# Altium schematic sheet MCU.SchDoc
size A4
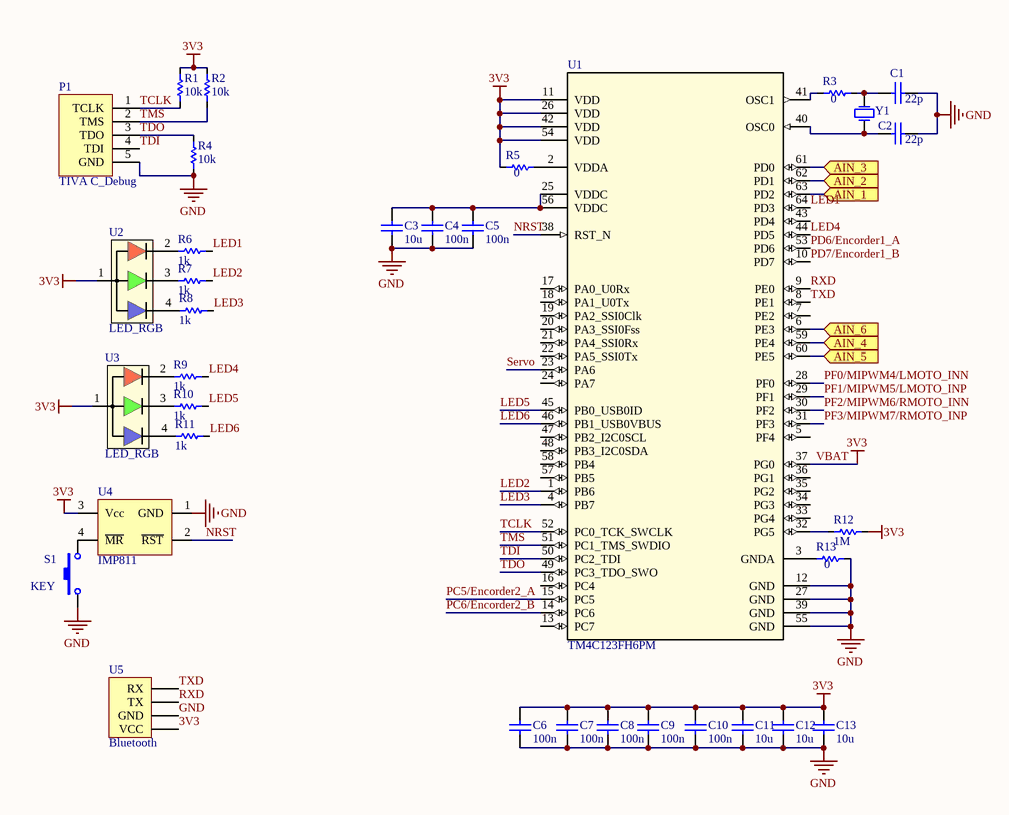
[diagram p0: MCU.SchDoc]

## Parts
C1  value 22p  [0603C]  (hidden comment: 1uF/0603/50V)
C2  value 22p  [0603C]  (hidden comment: 1uF/0603/50V)
C3  value 10u  [0603C]  (hidden comment: 1uF/0603/50V)
C4  value 100n  [0603C]  (hidden comment: 1uF/0603/50V)
C5  value 100n  [0603C]  (hidden comment: 1uF/0603/50V)
C6  value 100n  [0603C]  (hidden comment: 1uF/0603/50V)
C7  value 100n  [0603C]  (hidden comment: 1uF/0603/50V)
C8  value 100n  [0603C]  (hidden comment: 1uF/0603/50V)
C9  value 100n  [0603C]  (hidden comment: 1uF/0603/50V)
C10  value 100n  [0603C]  (hidden comment: 1uF/0603/50V)
C11  value 10u  [0603C]  (hidden comment: 1uF/0603/50V)
C12  value 10u  [0603C]  (hidden comment: 1uF/0603/50V)
C13  value 10u  [0603C]  (hidden comment: 1uF/0603/50V)
P1  TIVA C_Debug  [SMT_HEADER5]
R1  value 10k  [0603R]  (hidden comment: 1K/5%)
R2  value 10k  [0603R]  (hidden comment: 1K/5%)
R3  value 0  [0603R]  (hidden comment: 1K/5%)
R4  value 10k  [0603R]  (hidden comment: 1K/5%)
R5  value 0  [0603R]  (hidden comment: 1K/5%)
R6  value 1k  [0402]  (hidden comment: 1K/5%)
R7  value 1k  [0402]  (hidden comment: 1K/5%)
R8  value 1k  [0402]  (hidden comment: 1K/5%)
R9  value 1k  [0402]  (hidden comment: 1K/5%)
R10  value 1k  [0402]  (hidden comment: 1K/5%)
R11  value 1k  [0402]  (hidden comment: 1K/5%)
R12  value 1M  [0603R]  (hidden comment: 1K/5%)
R13  value 0  [0603R]  (hidden comment: 1K/5%)
S1  KEY  [SW-3x6mm-SMT]
U1  TM4C123FH6PM  [LQFP_64]
U2  LED_RGB  [0603 RGB]
U3  LED_RGB  [0603 RGB]
U4  IMP811  [SOT143]
U5  Bluetooth  [SMT_Female HEADER4]
Y1  XTAL  [NX5032GA]  (value not drawn)

## Ports
AIN_1 (in), AIN_2 (in), AIN_3 (in), AIN_4 (in), AIN_5 (in), AIN_6 (in)

## Nets
3V3: C6.2 C7.2 C8.2 C9.2 C10.2 C11.2 C12.2 C13.2 R1.1 R2.1 R5.2 R12.1 U1.11(VDD) U1.26(VDD) U1.37(PG0) U1.42(VDD) U1.54(VDD) U2.1(COM) U3.1(COM) U4.3(Vcc) U5.4(VCC)  [also labelled VBAT]
GND: C1.1 C2.1 C3.1 C4.1 C5.1 C6.1 C7.1 C8.1 C9.1 C10.1 C11.1 C12.1 C13.1 P1.5(GND) R4.2 R13.1 S1.2 U1.12(GND) U1.27(GND) U1.39(GND) U1.55(GND) U4.1(GND) U5.3(GND)
AIN_1: U1.63(PD2) ; port AIN_1
AIN_2: U1.62(PD1) ; port AIN_2
AIN_3: U1.61(PD0) ; port AIN_3
AIN_4: U1.59(PE4) ; port AIN_4
AIN_5: U1.60(PE5) ; port AIN_5
AIN_6: U1.6(PE3) ; port AIN_6
LED1: R6.2 U1.64(PD3)
LED2: R7.2 U1.1(PB6)
LED3: R8.2 U1.4(PB7)
LED4: R9.2 U1.44(PD5)
LED5: R10.2 U1.45(PB0_USB0ID)
LED6: R11.2 U1.46(PB1_USB0VBUS)
NRST: U1.38(RST_N) U4.2(~{RST})
PC5/Encorder2_A: U1.15(PC5)
PC6/Encorder2_B: U1.14(PC6)
PD6/Encorder1_A: U1.53(PD6)
PD7/Encorder1_B: U1.10(PD7)
PF0/MIPWM4/LMOTO_INN: U1.28(PF0)
PF1/MIPWM5/LMOTO_INP: U1.29(PF1)
PF2/MIPWM6/RMOTO_INN: U1.30(PF2)
PF3/MIPWM7/RMOTO_INP: U1.31(PF3)
RXD: U1.9(PE0) U5.2(TX)
Servo: U1.23(PA6)
TCLK: P1.1(TCLK) R1.2 U1.52(PC0_TCK_SWCLK)
TDI: P1.4(TDI) U1.50(PC2_TDI)
TDO: P1.3(TDO) R4.1 U1.49(PC3_TDO_SWO)
TMS: P1.2(TMS) R2.2 U1.51(PC1_TMS_SWDIO)
TXD: U1.8(PE1) U5.1(RX)
NetC1_2: C1.2 R3.1 Y1.2(OSC2)
NetC2_2: C2.2 U1.40(OSC0) Y1.1(OSC1)
NetC3_2: C3.2 C4.2 C5.2 U1.25(VDDC) U1.56(VDDC)
NetR3_2: R3.2 U1.41(OSC1)
NetR5_1: R5.1 U1.2(VDDA)
NetR6_1: R6.1 U2.2
NetR7_1: R7.1 U2.3
NetR8_1: R8.1 U2.4
NetR9_1: R9.1 U3.2
NetR10_1: R10.1 U3.3
NetR11_1: R11.1 U3.4
NetR12_2: R12.2 U1.32(PG5)
NetR13_2: R13.2 U1.3(GNDA)
NetS1_1: S1.1 U4.4(~{MR})

Not connected (* = marked no-connect by the designer): U1 5(PF4) 7(PE2) 13(PC7) 16(PC4) 17(PA0_U0Rx) 18(PA1_U0Tx) 19(PA2_SSI0Clk) 20(PA3_SSI0Fss) 21(PA4_SSI0Rx) 22(PA5_SSI0Tx) 24(PA7) 33(PG4) 34(PG3) 35(PG2) 36(PG1) 43(PD4) 47(PB2_I2C0SCL) 48(PB3_I2C0SDA) 57(PB5) 58(PB4)

## Library data of the parts
C1-C13 = Cap: Capacitor; Published: 8-Jun-2000; LatestRevisionDate: 17-Jul-2002; LatestRevisionNote: Re-released for DXP Platform.; PackageReference: RAD-0.3; Publisher: Altium Limited; PackageDescription: Radial Cap, Thru-Hole; 2 Leads; 0.3 in Pin Spacing
R1-R13 = Res1: Resistor; Published: 8-Jun-2000; LatestRevisionDate: 17-Jul-2002; LatestRevisionNote: Re-released for DXP Platform.; PackageReference: AXIAL-0.3; Publisher: Altium Limited; PackageDescription: Axial Device, Thru-Hole; 2 Leads; 0.3 in Pin Spacing
S1 = PushButton_2p: Button; Published: 24-Mar-1999; LatestRevisionDate: 17-Jul-2002; LatestRevisionNote: Re-released for DXP Platform.; PackageReference: SPST-2; Publisher: Altium Limited; PackageDescription: Switch; 2 Leads
U4 = IMP811: 复位芯片
U5 = Bluetooth: Bluetooth Module
Y1 = XTAL: Crystal Oscillator; Published: 8-Jun-2000; LatestRevisionDate: 17-Jul-2002; LatestRevisionNote: Re-released for DXP Platform.; PackageReference: R38; Publisher: Altium Limited; PackageDescription: Crystal, Thru-Hole; 2 Leads; Body 3.1 x 8.2 mm (Dia.xH)